# Altium schematic sheet LTC5584.SchDoc
size A2; SheetNumber: 1; SheetTotal: 1
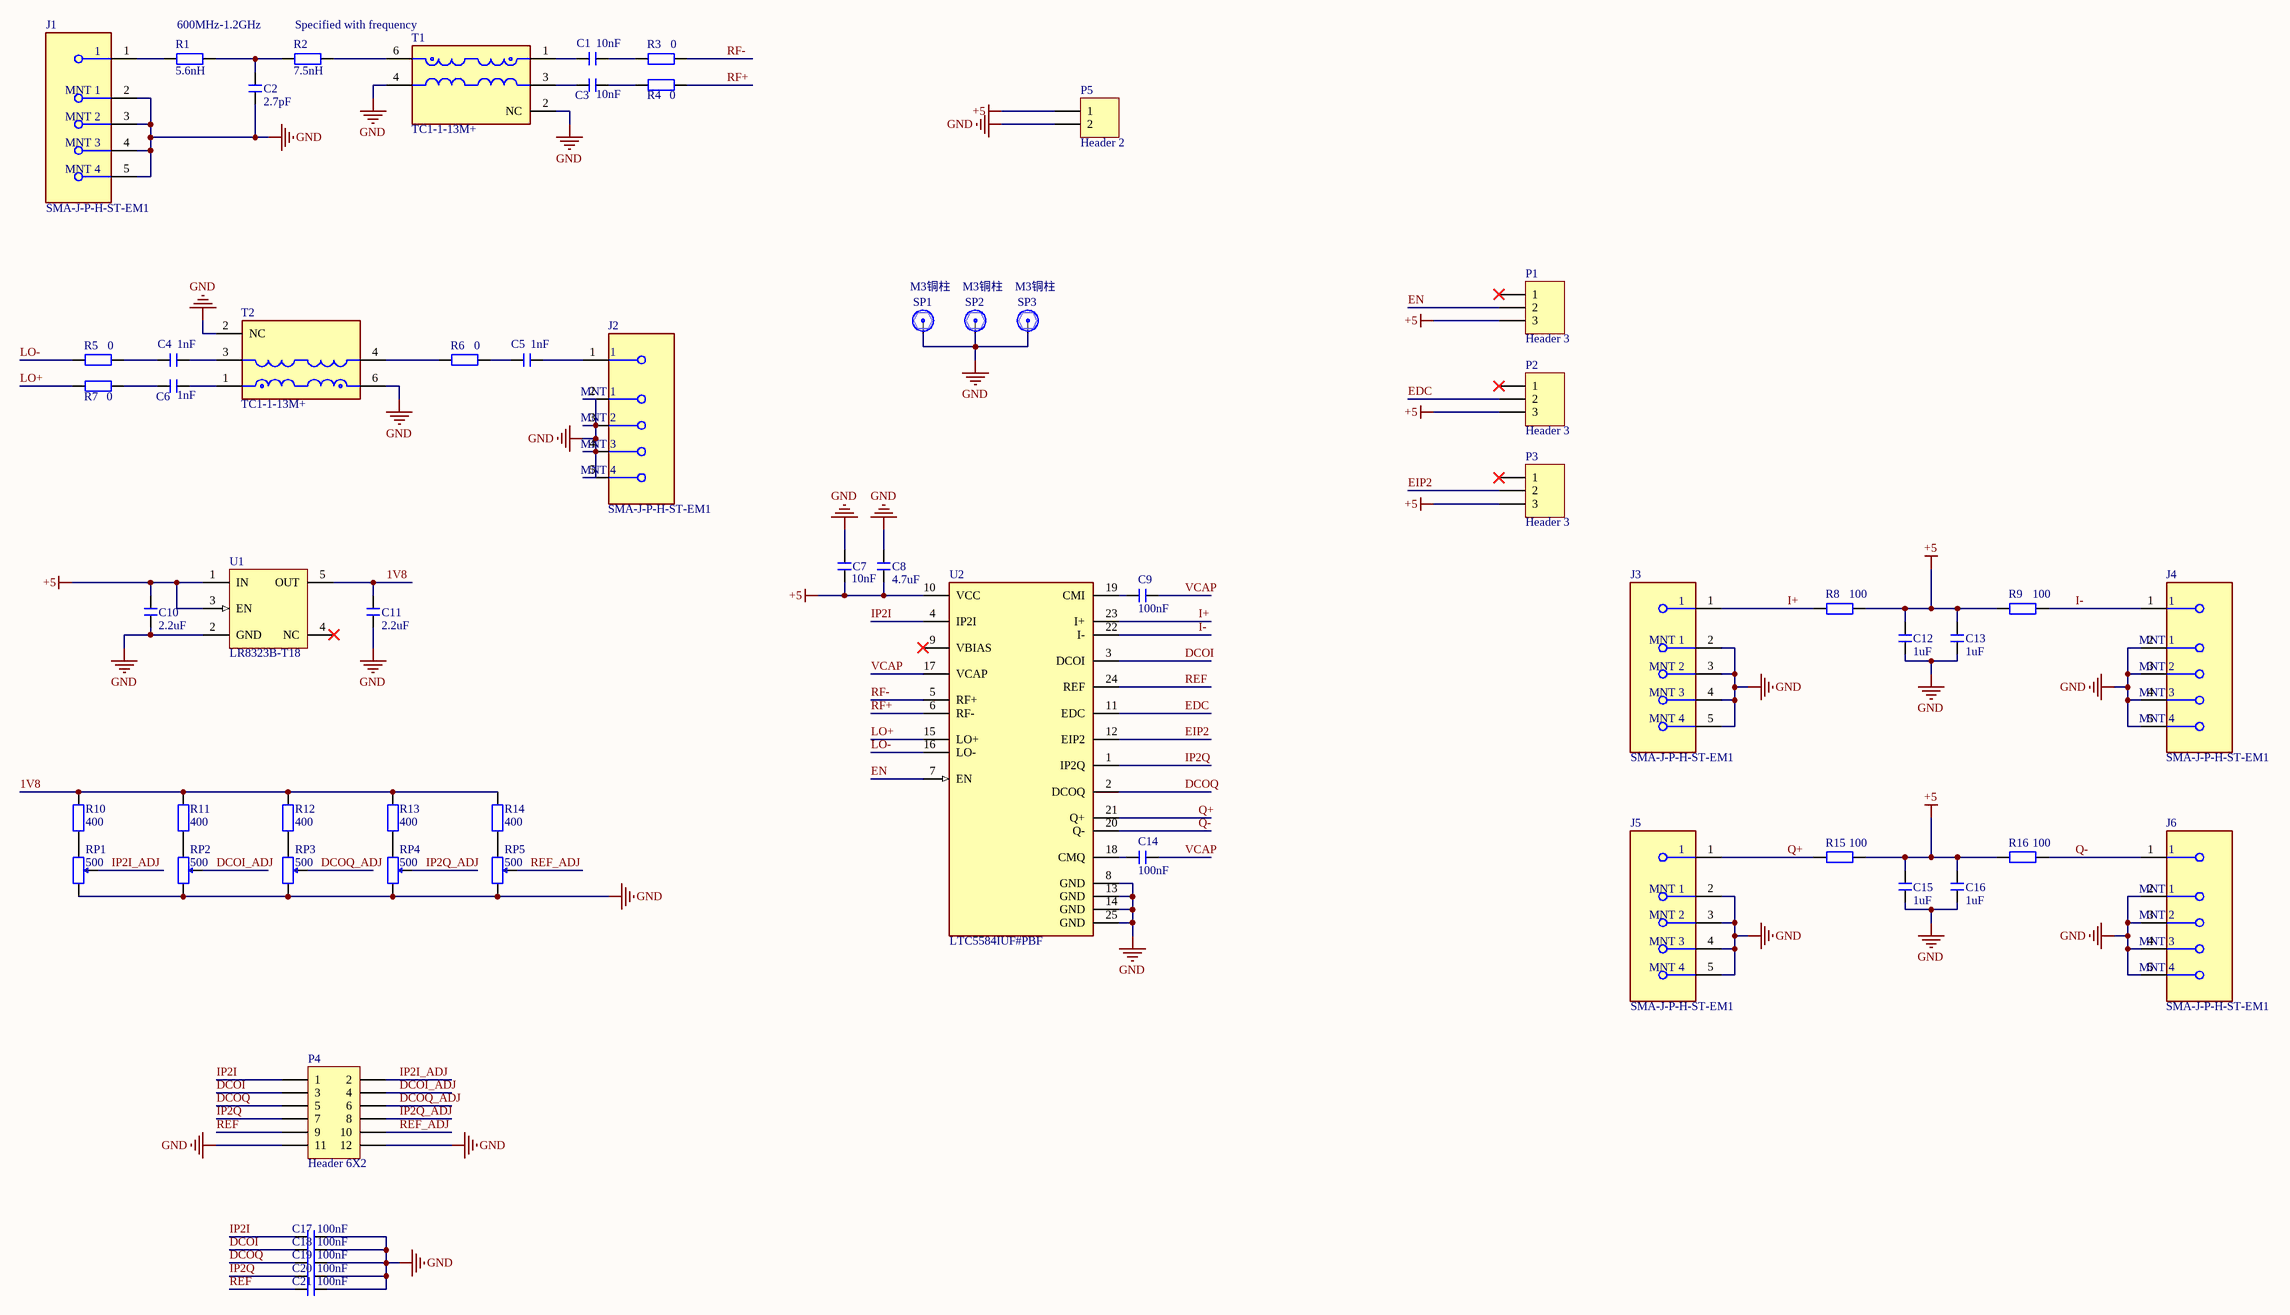
[diagram p0: LTC5584.SchDoc]

## Parts
C1  10nF  [C 0402_L]
C2  2.7pF  [C 0402_L]
C3  10nF  [C 0402_L]
C4  1nF  [C 0402_L]
C5  1nF  [C 0402_L]
C6  1nF  [C 0402_L]
C7  10nF  [C 0402_L]
C8  4.7uF  [C 0603_L]
C9  100nF  [C 0402_L]
C10  2.2uF  [C 0603_L]
C11  2.2uF  [C 0603_L]
C12  1uF  [C 0402_L]
C13  1uF  [C 0402_L]
C14  100nF  [C 0402_L]
C15  1uF  [C 0402_L]
C16  1uF  [C 0402_L]
C17  100nF  [C 0402_L]
C18  100nF  [C 0402_L]
C19  100nF  [C 0402_L]
C20  100nF  [C 0402_L]
C21  100nF  [C 0402_L]
J1  SMA-J-P-H-ST-EM1  [FP-SMA-J-P-H-ST-EM1-MFG]
J2  SMA-J-P-H-ST-EM1  [FP-SMA-J-P-H-ST-EM1-MFG]
J3  SMA-J-P-H-ST-EM1  [FP-SMA-J-P-H-ST-EM1-MFG]
J4  SMA-J-P-H-ST-EM1  [FP-SMA-J-P-H-ST-EM1-MFG]
J5  SMA-J-P-H-ST-EM1  [FP-SMA-J-P-H-ST-EM1-MFG]
J6  SMA-J-P-H-ST-EM1  [FP-SMA-J-P-H-ST-EM1-MFG]
P1  Header 3  [HDR1X3]
P2  Header 3  [HDR1X3]
P3  Header 3  [HDR1X3]
P4  Header 6X2  [HDR2X6]
P5  Header 2  [HDR1X2]
R1  5.6nH  [R 0402_L]
R2  7.5nH  [R 0402_L]
R3  0  [R 0402_L]
R4  0  [R 0402_L]
R5  0  [R 0402_L]
R6  0  [R 0402_L]
R7  0  [R 0402_L]
R8  100  [R 0402_L]
R9  100  [R 0402_L]
R10  400  [R 0603_L]
R11  400  [R 0603_L]
R12  400  [R 0603_L]
R13  400  [R 0603_L]
R14  400  [R 0603_L]
R15  100  [R 0402_L]
R16  100  [R 0402_L]
RP1  500  [3303W]
RP2  500  [3303W]
RP3  500  [3303W]
RP4  500  [3303W]
RP5  500  [3303W]
SP1  M3铜柱  [M3x4_N]
SP2  M3铜柱  [M3x4_N]
SP3  M3铜柱  [M3x4_N]
T1  TC1-1-13M+  [FP-TC1-1-13M+-MFG]
T2  TC1-1-13M+  [FP-TC1-1-13M+-MFG]
U1  LR8323B-T18  [DBV0005A_L]
U2  LTC5584IUF#PBF  [FP-UF-24-05-08-1697-IPC_A]

## Nets
+5: C7.1 C8.1 C10.2 C12.2 C13.2 C15.2 C16.2 P1.3 P2.3 P3.3 P5.1 R8.2 R9.1 R15.2 R16.1 U1.1(IN) U1.3(EN) U2.10(VCC)
GND: C2.1 C7.2 C8.2 C10.1 C11.1 C12.1 C13.1 C15.1 C16.1 C17.2 C18.2 C19.2 C20.2 C21.2 J1.2(MNT_1) J1.3(MNT_2) J1.4(MNT_3) J1.5(MNT_4) J2.2(MNT_1) J2.3(MNT_2) J2.4(MNT_3) J2.5(MNT_4) J3.2(MNT_1) J3.3(MNT_2) J3.4(MNT_3) J3.5(MNT_4) J4.2(MNT_1) J4.3(MNT_2) J4.4(MNT_3) J4.5(MNT_4) J5.2(MNT_1) J5.3(MNT_2) J5.4(MNT_3) J5.5(MNT_4) J6.2(MNT_1) J6.3(MNT_2) J6.4(MNT_3) J6.5(MNT_4) P4.11 P4.12 P5.2 RP1.3 RP2.3 RP3.3 RP4.3 RP5.3 SP1.1 SP2.1 SP3.1 T1.2(NC) T1.4(PRIMARY) T2.2(NC) T2.6(PRIMARY_DOT) U1.2(GND) U2.8(GND) U2.13(GND) U2.14(GND) U2.25(GND)
1V8: C11.2 R10.2 R11.2 R12.2 R13.2 R14.2 U1.5(OUT)
DCOI: C18.1 P4.3 U2.3(DCOI)
DCOI_ADJ: P4.4 RP2.2
DCOQ: C19.1 P4.5 U2.2(DCOQ)
DCOQ_ADJ: P4.6 RP3.2
EDC: P2.2 U2.11(EDC)
EIP2: P3.2 U2.12(EIP2)
EN: P1.2 U2.7(EN)
I+: J3.1 R8.1 U2.23(I+)
I-: J4.1 R9.2 U2.22(I-)
IP2I: C17.1 P4.1 U2.4(IP2I)
IP2I_ADJ: P4.2 RP1.2
IP2Q: C20.1 P4.7 U2.1(IP2Q)
IP2Q_ADJ: P4.8 RP4.2
LO+: R7.1 U2.15(LO+)
LO-: R5.1 U2.16(LO-)
Q+: J5.1 R15.1 U2.21(Q+)
Q-: J6.1 R16.2 U2.20(Q-)
REF: C21.1 P4.9 U2.24(REF)
REF_ADJ: P4.10 RP5.2
RF+: R4.2 U2.6(RF-)
RF-: R3.2 U2.5(RF+)
VCAP: C9.1 C14.1 U2.17(VCAP)
NetC1_1: C1.1 T1.1(SECONDARY_DOT)
NetC1_2: C1.2 R3.1
NetC2_2: C2.2 R1.2 R2.1
NetC3_1: C3.1 T1.3(SECONDARY)
NetC3_2: C3.2 R4.1
NetC4_1: C4.1 R5.2
NetC4_2: C4.2 T2.3(SECONDARY)
NetC5_1: C5.1 R6.2
NetC5_2: C5.2 J2.1
NetC6_1: C6.1 R7.2
NetC6_2: C6.2 T2.1(SECONDARY_DOT)
NetC9_2: C9.2 U2.19(CMI)
NetC14_2: C14.2 U2.18(CMQ)
NetJ1_1: J1.1 R1.1
NetR2_2: R2.2 T1.6(PRIMARY_DOT)
NetR6_1: R6.1 T2.4(PRIMARY)
NetR10_1: R10.1 RP1.1
NetR11_1: R11.1 RP2.1
NetR12_1: R12.1 RP3.1
NetR13_1: R13.1 RP4.1
NetR14_1: R14.1 RP5.1

Not connected (* = marked no-connect by the designer): P1 1*; P2 1*; P3 1*; U1 4(NC)*; U2 9(VBIAS)*

## Notes on the sheet
- (near R1) 600MHz-1.2GHz
- Specified with frequency

## Library data of the parts
C1-C21 = C: 贴片电容; 淘宝ID: 小糖豆的小窝窝; BOM名称: 贴片电容; 下单链接: https://item.taobao.com/item.htm?ft=t&id=613637044352
J1-J6 = CMP-02754-000006-1: CONN SMA JACK STR 50OHM EDGE MNT; Dielectric Material: PTFE; Center Contact Plating: Gold; Max Frequency: 6GHz; Body Material: Brass; Voltage Rating: 335V; Impedance: 50R; Package Quantity: 1; Case/Package: SMA; Max Operating Temperature: 125°C; Fastening Type: Threaded; Orientation: Straight; Depth: 13.33mm; RoHS Compliant: Yes; Length: 6.35mm; Insulation Material: Polytetrafluoroethylene; Termination: Solder; Min Operating Temperature: -65°C; Housing Color: Gold; Contact Plating: Gold; Contact Material: Copper; Connector Type: SMA; Mount: Edge; Series: SMA; Packaging: Tray; Body Plating: Gold; Radiation Hardening: No
P1-P3 = Header 3: Header, 3-Pin; LatestRevisionDate: 17-Jul-2002; LatestRevisionNote: Re-released for DXP Platform.; Publisher: Altium Limited
P4 = Header 6X2: Header, 6-Pin, Dual row; LatestRevisionDate: 17-Jul-2002; LatestRevisionNote: Re-released for DXP Platform.; Publisher: Altium Limited
P5 = Header 2: Header, 2-Pin; LatestRevisionDate: 17-Jul-2002; LatestRevisionNote: Re-released for DXP Platform.; Publisher: Altium Limited
R1-R16 = R: 贴片电阻; 淘宝ID: 小糖豆的小窝窝; BOM名称: 贴片电阻; 下单链接: https://item.taobao.com/item.htm?ft=t&id=613637044352
RP1-RP5 = RP-SMD: 贴片电位器; 淘宝ID: 小糖豆的小窝窝; BOM名称: 贴片电位器; 下单链接: https://item.taobao.com/item.htm?ft=t&id=613637044352
SP1-SP3 = 铜柱大焊盘: 铜柱; 淘宝ID: 小糖豆的小窝窝; BOM名称: 铜柱; 下单链接: https://item.taobao.com/item.htm?ft=t&id=613637044352
T1 T2 = CMP-199822-000006-1: RF Transformer Surface Mount 50Ω 4.5 to 3000 MHz; Manufacturer: Mini-Circuits; Insertion Loss: 0.18-3.02dB; Frequency: 4.5-3000MHz; Turns Ratio: 1:1; RoHS: TRUE; Temperature Range Low: -40°C; Manufacturer Part Number: TC1-1-13M+; Octopart: https://octopart.com/tc1-1-13m%2B-mini-circuits-3993639; Automotive: No; ComponentLink2URL: https://www.minicircuits.com/pdfs/TC1-1-13M+.pdf; Device Class L2: Transformers; Device Class L1: Passive Components; Lead Free: Yes; Device Class L3: unset; Category: Trans; Temperature Range High: +85°C; Package: 0; Footprint Url: https://www.minicircuits.com/case_style/AT224-1A.pdf; Temperature: -40°C to +85°C; Height: 4.06mm; ComponentLink2Description: Datasheet
U1 = LR8323B-T18: None
U2 = CMP-09141-000307-1: RF DEMOD IC 30MHZ-1.4GHZ 24QFN; Min Frequency: 30MHz; Max Frequency: 1.4GHz; Noise Figure: 9.9dB; Min Supply Voltage: 4.75V; Max Supply Voltage: 5.25V; Gain: 5.4dB; RoHS Compliant: Yes; Radiation Hardening: No; Lead Free: Lead Free; Number of Pins: 24; Min Operating Temperature: -40°C; Case/Package: QFN; Packaging: Rail/Tube; Max Operating Temperature: 105°C; Reach SVHC Compliant: Yes; Package Quantity: 91